# EAGLE schematic piezo-preamp-tickler_V3-4_single-supply-OPA1642_backup (EAGLE 8.5.0)

## Sheet 1 of 2
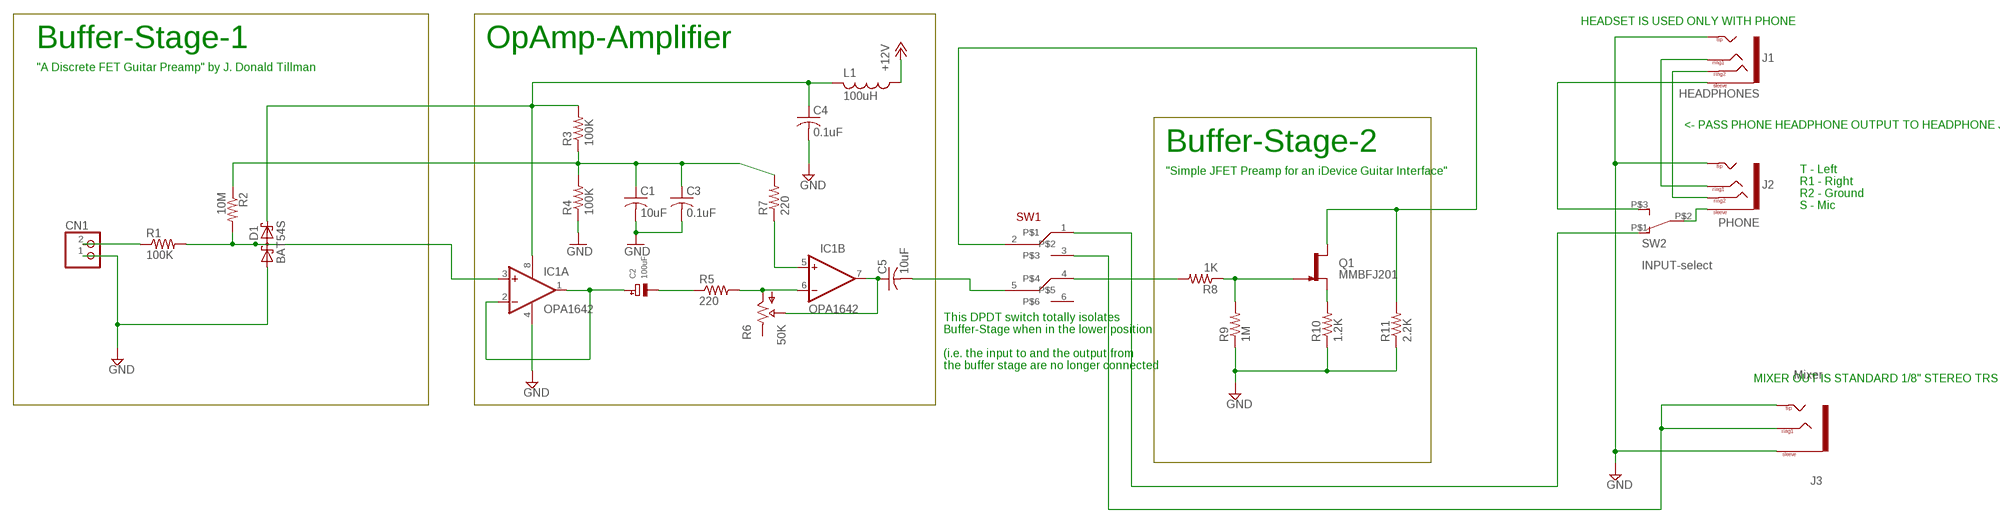
[diagram p0: schematic, sheet 1]

### Parts
C1  10uF  C-USC0805K  [C0805K]
C2  100uF  CAP_TANTALUMA/3216_REFLOW  [EIA3216-18/A-R]
C3  0.1uF  C-USC0805K  [C0805K]
C4  0.1uF  C-USC0805K  [C0805K]
C5  10uF  C-USC0805  [C0805]
CN1  JST_2PIN-THM  [JST-PH-2-THM]
D1  BAT54S  [SOT23]
IC1  OPA1642  OPA2134UA  [SO08]
J1  HEADPHONES  TRRS-1/8"-3.5MMLGPADS  [TRRS_SJ-43514-SMT-TR]
J2  PHONE  TRRS-1/8"-3.5MMLGPADS  [TRRS_SJ-43514-SMT-TR]
J3  Mixer  TRS-1/8"-3.5MM  [TRS_SJ-3524-SMT]
L1  100uH  L-USL3225P  [L3225P]
Q1  MMBFJ201  J201SOT-23  [SOT23-3]
R1  100K  R-US_R0603  [R0603]
R2  10M  R-US_R0603  [R0603]
R3  100K  R-US_R0603  [R0603]
R4  100K  R-US_R0603  [R0603]
R5  220  R-US_R0603  [R0603]
R6  50K  POTPOT-THUMB-ALPHA  [POT-THUMB-14MM_ALPHA-RV100F-30-4K1B-B10K-B301]
R7  220  R-US_R0603  [R0603]
R8  1K  R-US_R0603  [R0603]
R9  1M  R-US_R0603  [R0603]
R10  1.2K  R-US_R0603  [R0603]
R11  2.2K  R-US_R0603  [R0603]
SW1  SWITCH_DPDT  [SWITCH_DPDT_CL-SB-22B]
SW2  INPUT-select  SWITCH_SPDTCL-SB-12B  [SWITCH_SPDT_CL-SB-12B]

### Nets
+12V: L1.1 ; also sheet 2
GND: C1.2 C3.2 C4.2 CN1.1 D1.1(A1) IC1.4(A:V-) J1.TIP J2.TIP J3.1(SLEEVE) R4.1 R9.1 R10.1 R11.1 ; also sheet 2
N$2: CN1.2 R1.1
N$3: Q1.2(S) R10.2
N$4: J1.EARTH(SLEEVE)
N$5: IC1.5(B:+IN) R7.1
N$6: C5.1 IC1.7(B:OUT) R6.P$3(WIPER)
N$7: IC1.6(B:-IN) R5.2 R6.P$1(IN)
N$9: D1.3(C1A2) IC1.3(A:+IN) R1.2 R2.2
N$10: Q1.3(G) R8.1 R9.2
N$11: R8.2 SW1.4
N$12: J3.2(TIP) J3.3(RING1) J3.4(TIP) SW1.3
N$13: J1.RING1 J2.RING1
N$14: C2.- R5.1
N$15: J1.RING2 J2.RING2
N$16: C5.2 SW1.5
N$17: J2.EARTH(SLEEVE) SW2.P$2
N$19: SW1.1 SW2.P$1
N$23: C1.1 C3.1 R2.1 R3.1 R4.2 R7.2
N$24: C2.+ IC1.1(A:OUT) IC1.2(A:-IN)
N$25: C4.1 D1.2(C2) IC1.8(A:V+) L1.2 R3.2
SELECT: Q1.1(D) R11.2 SW1.2
Unconnected: R6.P$2(OUT) SW1.6 SW2.P$3

### Notes on the sheet
- HEADSET IS USED ONLY WITH PHONE
- Buffer-Stage-1 | OpAmp-Amplifier
- "A Discrete FET Guitar Preamp" by J. Donald Tillman
- <- PASS PHONE HEADPHONE OUTPUT TO HEADPHONE JACK
- Buffer-Stage-2
- "Simple JFET Preamp for an iDevice Guitar Interface"
- T - Left
  R1 - Right
  R2 - Ground
  S - Mic
- This DPDT switch totally isolates 
  Buffer-Stage when in the lower position
  
  (i.e. the input to and the output from 
  the buffer stage are no longer connected
- MIXER OUT IS STANDARD 1/8" STEREO TRS

## Sheet 2 of 2
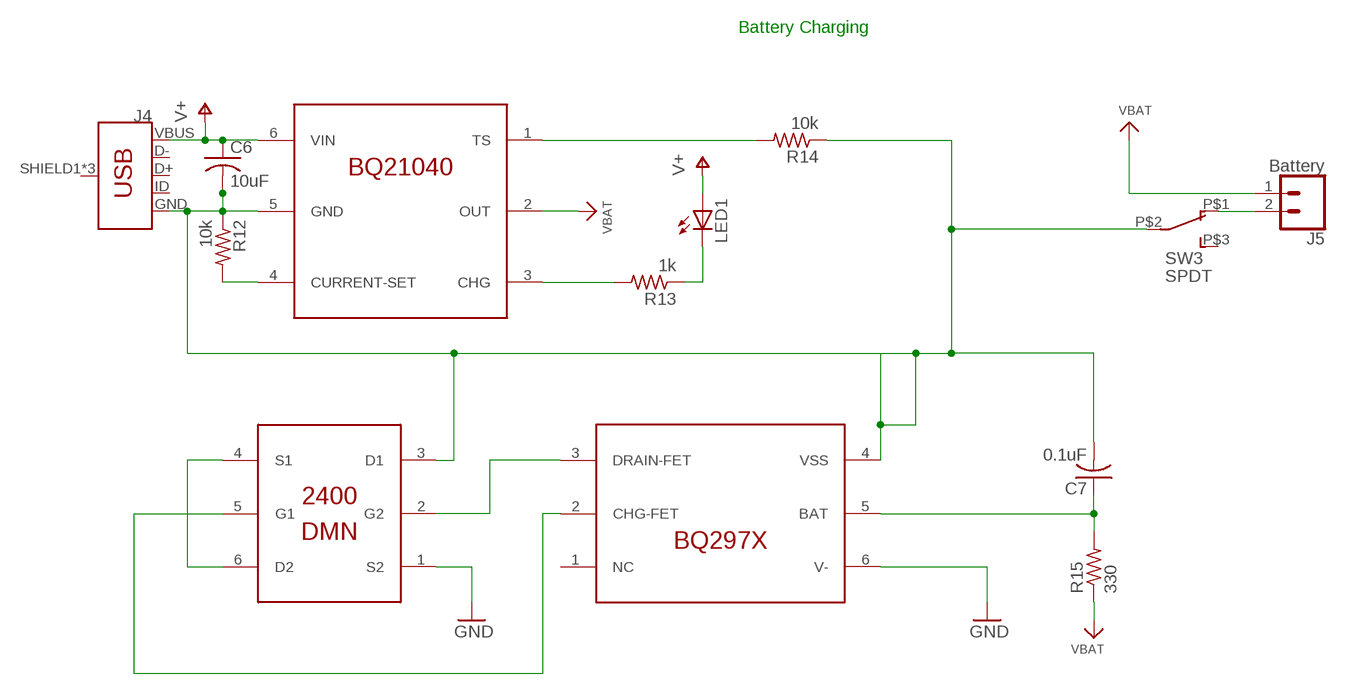
[diagram p1: schematic, sheet 2, part 1 of 2]
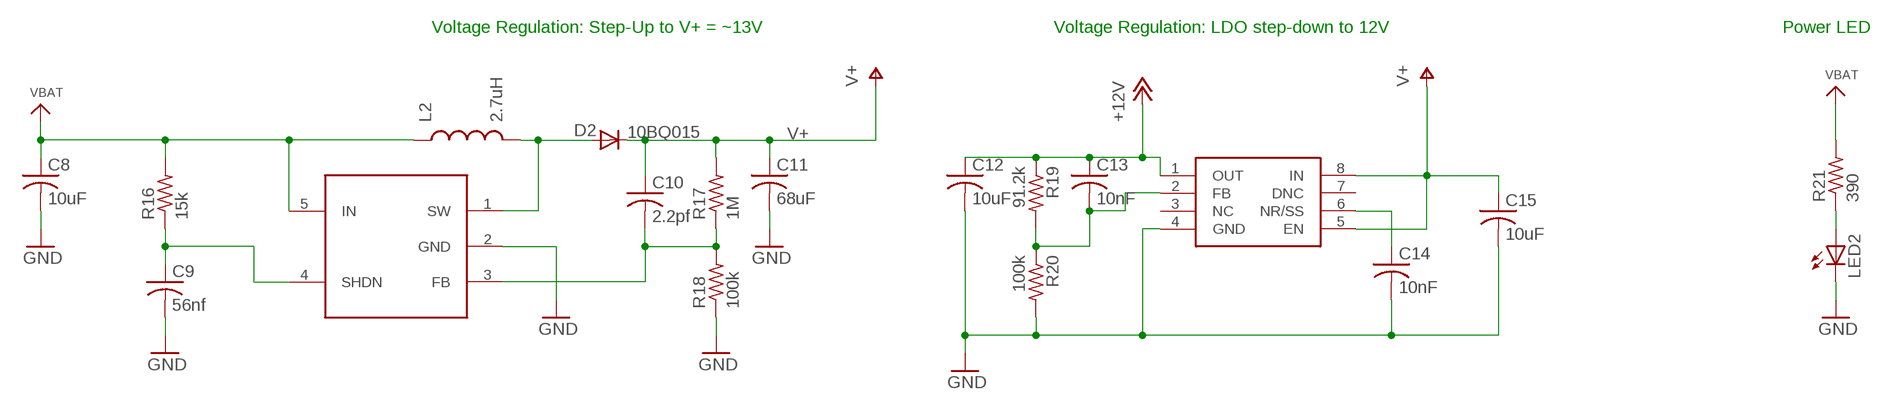
[diagram p2: schematic, sheet 2, part 2 of 2]

### Parts
C6  10uF  C-USC0805K  [C0805K]
C7  0.1uF  C-USC0805K  [C0805K]
C8  10uF  C-USC0603  [C0603]
C9  56nf  C-USC0603  [C0603]
C10  2.2pf  C-USC0603  [C0603]
C11  68uF  C-USC0603  [C0603]
C12  10uF  C-USC0603  [C0603]
C13  10nF  C-USC0603  [C0603]
C14  10nF  C-USC0603  [C0603]
C15  10uF  C-USC0603  [C0603]
D2  10BQ015  DIODESMA  [SMA-DIODE]
IC2  DMN2400  DUAL-NFET-DMN2400  [SOT-563]
IC3  BQ21040  BQ21040-LIPO-CHARGER  [SOT23-6]
IC4  BQ297X  BQ297X-BATTERY-MANAGER  [WSON-6]
IC5  TPS7A49  [MSOP-8]
J4  USB_MICRO-BREDUCED_PASTE  [USB-B-MICRO-SMD_RED_PASTE]
J5  Battery  CONN_02LOCK  [1X02_LOCK]
L2  2.7uH  INDUCTORCR54  [CR54]
LED1  LED3MM  [LED3MM]
LED2  LED3MM  [LED3MM]
Q2  SC4503  [SOT23-5]
R12  10k  R-US_R0805  [R0805]
R13  1k  R-US_R0805  [R0805]
R14  10k  R-US_R0805  [R0805]
R15  330  R-US_R0805  [R0805]
R16  15k  R-US_R0603  [R0603]
R17  1M  R-US_R0603  [R0603]
R18  100k  R-US_R0603  [R0603]
R19  91.2k  R-US_R0603  [R0603]
R20  100k  R-US_R0603  [R0603]
R21  390  R-US_R0805  [R0805]
SW3  SPDT  SWITCH_SPDTCL-SB-12B  [SWITCH_SPDT_CL-SB-12B]

### Nets
+12V: C12.1 C13.1 IC5.1(OUT) R19.1 ; also sheet 1
GND: C8.2 C9.2 C11.2 C12.2 C14.2 C15.2 IC2.1(S2) IC4.6(V-) IC5.4(GND) LED2.K(C) Q2.2(GND) R18.1 R20.2 ; also sheet 1
GND2: C6.2 C7.2 IC2.3(D1) IC3.5(GND) IC4.4(VSS) J4.GND R12.1 R14.1 SW3.P$2
N$18: LED2.A R21.1
N$20: J5.2 SW3.P$1
N$22: LED1.K(C) R13.1
N$26: C13.2 IC5.2(FB) R19.2 R20.1
N$27: IC3.3(CHG) R13.2
N$28: C14.1 IC5.6(NR/SS)
N$29: C9.1 Q2.4(SHDN) R16.1
N$30: C10.2 Q2.3(FB) R17.1 R18.2
N$31: IC3.1(TS) R14.2
N$32: D2.A L2.P$2 Q2.1(SW)
N$36: IC3.4(CURRENT-SET) R12.2
N$42: C7.1 IC4.5(BAT) R15.2
N$43: IC2.4(S1) IC2.6(D2)
N$44: IC2.5(G1) IC4.2(CHG-FET)
N$45: IC2.2(G2) IC4.3(DRAIN-FET)
V+: C6.1 C10.1 C11.1 C15.1 D2.C IC3.6(VIN) IC5.5(EN) IC5.8(IN) J4.VBUS LED1.A R17.2
VBAT: C8.1 IC3.2(OUT) J5.1 L2.P$1 Q2.5(IN) R15.1 R16.2 R21.2
Unconnected: IC4.1(NC) IC5.3(NC) IC5.7(DNC) J4.D+ J4.D- J4.ID J4.SHIELD1(SHIELD) J4.SHIELD2(SHIELD) J4.SHIELD3(SHIELD) SW3.P$3

### Notes on the sheet
- Battery Charging
- Voltage Regulation: Step-Up to V+ = ~13V | Voltage Regulation: LDO step-down to 12V | Power LED

## Library data of the parts
C1 C3-C15 = adafruit:C-US: CAPACITOR, American symbol
C2 = microbuilder:CAP_TANTALUM: Tantalum Capacitors Wave footprints have larger pads and are meant to be used for hand soldering. Reflow footprints are optimised for solder paste and a reflow oven. EIA3216-18/A-[R/W] - Size A / 3216-18 / 1206 footprint 4.7µF 25V 10% Tantalum Capacitor 10µF 16V 10% Tantalum Capacitor [Digikey: 495-2236-2-ND] EIA3528-21/B-[R/W] - Size B / 3528-21 47µF 10V 10% Tantalum Capactior [Digikey: 495-2216-1-ND] EIA6032-28/C-[R/W] - Size C / 6032-28 10µF 35V 20% Tantalum Capacitor [Digikey: 495-2285-1-ND] 100µF 16V 10% Tantalum Capactior [Digikey: 399-5214-1-ND]
CN1 = adafruit:JST_2PIN: JST 2-Pin Connectors of various flavors SMT-RA (S2B-PH-SM4) 4UConnector #17311 SMT (B2B-PH-SM4) THM-RA (S2B-PH) THM (B2B-PH)
D1 = diode:BAT54S: Schottky Diodes Pin connection corrected 2011-05-04 Source: Fairchild .. BAT54.pdf
D2 = SparkFun:DIODE: Diode These are standard reverse protection diodes and small signal diodes. SMA package can handle up to about 1A. SOD-323 can handle about 200mA. What the SOD-323 package when ordering, there are some mfgs out there that are 5-pin packages.
IC1 = linear:OPA2*: Dual Operational Amplifier Low Power, Single-Supply, Rail-To-Rail Operational Amplifier Source: http://focus.ti.com/lit/ds/symlink/opa2345.pdf http://focus.ti.com .. opa241.pdf http://focus.ti.com/lit/ds/symlink/opa2134.pdf
IC2 = CMU-ArtFab:DUAL-NFET-DMN2400
IC3 = CMU-ArtFab:BQ21040-LIPO-CHARGER
IC4 = CMU-ArtFab:BQ297X-BATTERY-MANAGER
IC5 = CMU-ArtFab:TPS7A49
J1 J2 = CMU-ArtFab:TRRS-1/8"-3.5MM: Audio jack - 3.5mm TRRS variety - two rings.
J3 = CMU-ArtFab:TRS-1/8"-3.5MM
J4 = SparkFun-Connectors:USB_MICRO-B: USB Type Micro-B Connector Male/female and PTH/SMT variants SparkFun Products: SparkFun microB USB Breakout <https://www.sparkfun.com/products/12035> SparkFun USB microB Plug Breakout <https://www.sparkfun.com/products/10031> SparkFun ESP8266 Thing <https://www.sparkfun.com/products/13231>; PROD_ID: CONN-11752
J5 = SparkFun-Connectors:CONN_02: Multi connection point. Often used as Generic Header-pin footprint for 0.1 inch spaced/style header connections On any of the 0.1 inch spaced packages, you can populate with these: Break Away Headers - Straight <https://www.sparkfun.com/products/116> (PRT-00116) Break Away Male Headers - Right Angle <https://www.sparkfun.com/products/553> (PRT-00553) Female Headers <https://www.sparkfun.com/products/115> (PRT-00115) Break Away Headers - Machine Pin <https://www.sparkfun.com/products/117> (PRT-00117) Break Away Female Headers - Swiss Machine Pin <https://www.sparkfun.com/products/743> (PRT-00743) For SCREWTERMINALS and SPRING TERMINALS visit here: Screw Terimnals on SparkFun.com <https://www.sparkfun.com/search/results?term=Screw+Terminals> (5mm/3.5mm/2.54mm spacing) This device is also useful as a general connection point to wire up your design to another part of your project. Our various solder wires solder well into these plated through hole pads. Hook-Up Wire - Assortment (Stranded, 22 AWG) <https://www.sparkfun.com/products/11375> (PRT-11375) Hook-Up Wire - Assortment (Solid Core, 22 AWG) <https://www.sparkfun.com/products/11367> (PRT-11367) View the entire wire category on our website here <https://www.sparkfun.com/categories/141> Special notes: Molex polarized connector foot print use with: PRT-08233 with associated crimp pins and housings. 2.54_SCREWTERM for use with PRT-10571. 3.5mm Screw Terminal footprints for PRT-08084 5mm Screw Terminal footprints for use with PRT-08432
L1 = rcl:L-US: INDUCTOR, American symbol; SPICEPREFIX: L
L2 = SparkFun-Passives:INDUCTOR: Inductors Basic Inductor/Choke - 0603 and 1206. Footprints are not proven and vary greatly between part numbers. SRN6045- 33uH, 20% 1.4A SDR0403-560KL - 56uH, 10%, 500mA RMS/740mA peak
LED1 LED2 = led:LED: LED OSRAM: - CHIPLED LG R971, LG N971, LY N971, LG Q971, LY Q971, LO R971, LY R971 LH N974, LH R974 LS Q976, LO Q976, LY Q976 LO Q996 - Hyper CHIPLED LW Q18S LB Q993, LB Q99A, LB R99A - SideLED LS A670, LO A670, LY A670, LG A670, LP A670 LB A673, LV A673, LT A673, LW A673 LH A674 LY A675 LS A676, LA A676, LO A676, LY A676, LW A676 LS A679, LY A679, LG A679 - Hyper Micro SIDELED® LS Y876, LA Y876, LO Y876, LY Y876 LT Y87S - SmartLED LW L88C, LW L88S LB L89C, LB L89S, LG L890 LS L89K, LO L89K, LY L89K LS L896, LA L896, LO L896, LY L896 - TOPLED LS T670, LO T670, LY T670, LG T670, LP T670 LSG T670, LSP T670, LSY T670, LOP T670, LYG T670 LG T671, LOG T671, LSG T671 LB T673, LV T673, LT T673, LW T673 LH T674 LS T676, LA T676, LO T676, LY T676, LB T676, LH T676, LSB T676, LW T676 LB T67C, LV T67C, LT T67C, LS T67K, LO T67K, LY T67K, LW E67C LS E67B, LA E67B, LO E67B, LY E67B, LB E67C, LV E67C, LT E67C LW T67C LS T679, LY T679, LG T679 LS T770, LO T770, LY T770, LG T770, LP T770 LB T773, LV T773, LT T773, LW T773 LH T774 LS E675, LA E675, LY E675, LS T675 LS T776, LA T776, LO T776, LY T776, LB T776 LHGB T686 LT T68C, LB T68C - Hyper Mini TOPLED® LB M676 - Mini TOPLED Santana® LG M470 LS M47K, LO M47K, LY M47K Source: http://www.osram.convergy.de LUXEON: - LUMILED® LXK2-PW12-R00, LXK2-PW12-S00, LXK2-PW14-U00, LXK2-PW14-V00 LXK2-PM12-R00, LXK2-PM12-S00, LXK2-PM14-U00 LXK2-PE12-Q00, LXK2-PE12-R00, LXK2-PE12-S00, LXK2-PE14-T00, LXK2-PE14-U00 LXK2-PB12-K00, LXK2-PB12-L00, LXK2-PB12-M00, LXK2-PB14-N00, LXK2-PB14-P00, LXK2-PB14-Q00 LXK2-PR12-L00, LXK2-PR12-M00, LXK2-PR14-Q00, LXK2-PR14-R00 LXK2-PD12-Q00, LXK2-PD12-R00, LXK2-PD12-S00 LXK2-PH12-R00, LXK2-PH12-S00 LXK2-PL12-P00, LXK2-PL12-Q00, LXK2-PL12-R00 Source: www.luxeon.com KINGBRIGHT: KA-3528ASYC Source: www.kingbright.com
Q1 = CMU-ArtFab:J201: N-channel JFET
Q2 = CMU-ArtFab:SC4503
R1-R5 R7-R21 = CMU-ArtFab:R-US_: RESISTOR, American symbol
R6 = CMU-ArtFab:POT: http://www.taydaelectronics.com/10k-ohm-linear-taper-potentiometer-round-shaft-pcb-9mm.html http://www.taydaelectronics.com/datasheets/A-1847.pdf
SW1 = CMU-ArtFab:SWITCH_DPDT
SW2 SW3 = CMU-ArtFab:SWITCH_SPDT